# Altium schematic sheet FTDI.SchDoc
size A4; PageSetup: Record=PageOptions|CenterHorizontal=True|CenterVertical=True|PrintScale=1.00|XCorrection=1.00|YCorrection=1.00|PrintKind=2|BorderSize=5000000|LeftOffset=0|BottomOffset=0|Orientation=2|PaperLength=1000|PaperWidth=1000|Scale=100|PaperSource=7|PrintQuality=-3|MediaType=1|DitherType=10|PrintScaleMode=1|PaperKind=A4|PaperIndex=9
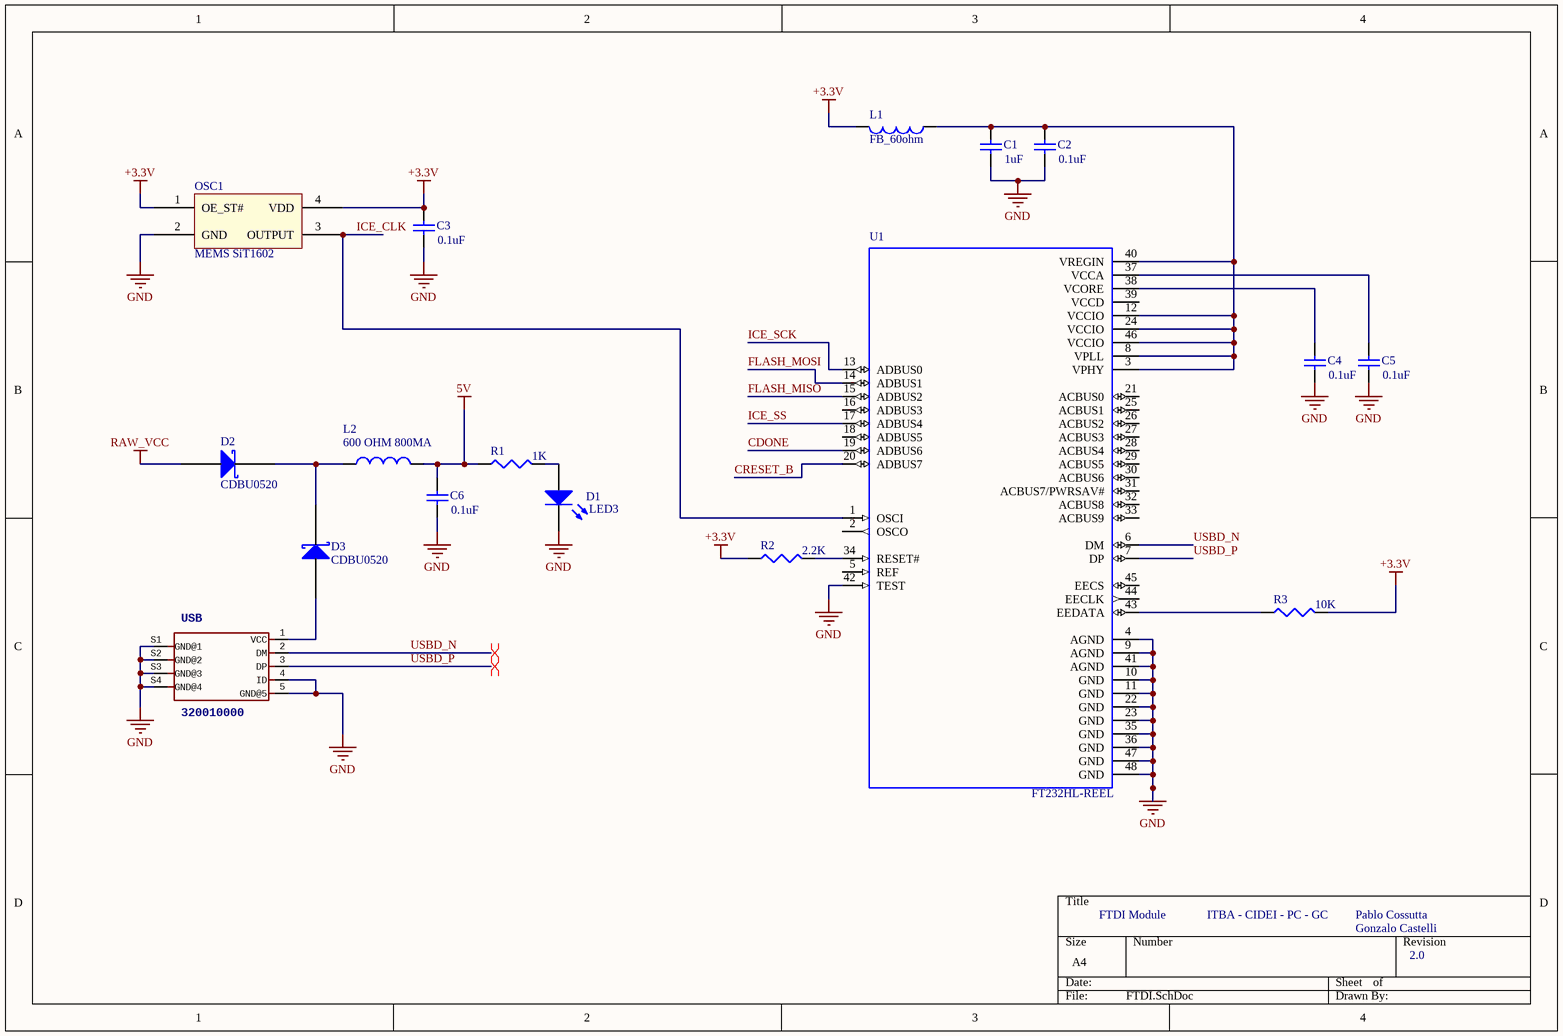
[diagram p0: FTDI.SchDoc]

## Parts
C1  value 1uF  [C0402]  (hidden comment: Cap Semi)
C2  value 0.1uF  [C0402]  (hidden comment: Cap Semi)
C3  value 0.1uF  [C0402]  (hidden comment: Cap Semi)
C4  value 0.1uF  [C0402]  (hidden comment: Cap Semi)
C5  value 0.1uF  [C0402]  (hidden comment: Cap Semi)
C6  value 0.1uF  [C0402]  (hidden comment: Cap Semi)
D1  LED3  [LED-0603]
D2  CDBU0520  [CDBU0520]
D3  CDBU0520  [CDBU0520]
L1  FB_60ohm  [J1-0603]
L2  600 OHM 800MA  [J1-0603]
OSC1  MEMS SiT1602  [oscMEMS1602]
R1  value 1K  [R0402]  (hidden comment: Res3)
R2  value 2.2K  [R0402]  (hidden comment: Res3)
R3  value 10K  [R0402]  (hidden comment: Res3)
U1  FT232HL-REEL  [QFP50P900X900X160-48N]
USB  320010000  [MICRO-USB5+4P-SMD-0.65-B]

## Nets
5V: C6.2 L2.2 R1.1
+3.3V: C3.2 L1.2 OSC1.1(OE_ST#) OSC1.4(VDD) R2.1 R3.2
GND: C1.1 C2.1 C3.1 C4.1 C5.1 C6.1 D1.2(K) OSC1.2(GND) U1.4(AGND) U1.9(AGND) U1.10(GND) U1.11(GND) U1.22(GND) U1.23(GND) U1.35(GND) U1.36(GND) U1.41(AGND) U1.42(TEST) U1.47(GND) U1.48(GND) USB.4(ID) USB.5(GND@5) USB.S1(GND@1) USB.S2(GND@2) USB.S3(GND@3) USB.S4(GND@4)
RAW_VCC: D2.1
CDONE: U1.19(ADBUS6)
CRESET_B: U1.20(ADBUS7)
FLASH_MISO: U1.15(ADBUS2)
FLASH_MOSI: U1.14(ADBUS1)
ICE_CLK: OSC1.3(OUTPUT) U1.1(OSCI)
ICE_SCK: U1.13(ADBUS0)
ICE_SS: U1.17(ADBUS4)
USBD_N: U1.6(DM) USB.2(DM)
USBD_P: U1.7(DP) USB.3(DP)
NetC1_2: C1.2 C2.2 L1.1 U1.3(VPHY) U1.8(VPLL) U1.12(VCCIO) U1.24(VCCIO) U1.40(VREGIN) U1.46(VCCIO)
NetC4_2: C4.2 U1.38(VCORE)
NetC5_2: C5.2 U1.37(VCCA)
NetD1_1: D1.1(A) R1.2
NetD2_2: D2.2 D3.2 L2.1
NetD3_1: D3.1 USB.1(VCC)
NetR2_2: R2.2 U1.34(RESET#)
NetR3_1: R3.1 U1.43(EEDATA)

Not connected (* = marked no-connect by the designer): U1 2(OSCO) 5(REF) 16(ADBUS3) 18(ADBUS5) 21(ACBUS0) 25(ACBUS1) 26(ACBUS2) 27(ACBUS3) 28(ACBUS4) 29(ACBUS5) 30(ACBUS6) 31(ACBUS7/PWRSAV#) 32(ACBUS8) 33(ACBUS9) 39(VCCD) 44(EECLK) 45(EECS)

## Layout directives
differential pair: USBD_N, USBD_P

## Notes on the sheet
- FTDI Module
- ITBA - CIDEI - PC - GC
- Pablo Cossutta
- Gonzalo Castelli
- 2.0

## Library data of the parts
C1 = Cap Semi: Capacitor (Semiconductor SIM Model); Manufacturer: TDK Corporation; Manufacturer Part Number: CGB2A1JB1E105M033BC; Tolerance: ±20%; Voltage - Rated: 25V; Temperature Coefficient: JB; Notification: Current market demand for these product types have resulted in fluctuating and extending lead times. Lead times may differ.; Published: 8-Jun-2000; LatestRevisionDate: 29-May-2009; LatestRevisionNote: IPC-7351 Footprint Added.; PackageReference: C1206; Publisher: Altium Limited; PackageDescription: Chip Capacitor; Supplier 1: Digi-Key; Supplier Part Number 1: 445-12016-1-ND; RoHS: RoHS Compliant; Category: Capacitors; Stock 1: 0; Pricing 1: 1=0.25, 10=0.173, 100=0.0874, 500=0.0598, 1000=0.0529, 2500=0.0506, 5000=0.046 (USD); Packaging: Cut Tape (CT); Part Status: Active; Operating Temperature: -25°C ~ 85°C; Features: Low Profile; Ratings: -; Applications: General Purpose; Failure Rate: -; Mounting Type: Surface Mount, MLCC; Package / Case: 0402 (1005 Metric); Size / Dimension: 0.039" L x 0.020" W (1.00mm x 0.50mm); Height - Seated (Max): -; Thickness (Max): 0.013" (0.33mm); Lead Spacing: -; Lead Style: -; ComponentLink1URL: https://product.tdk.com/info/en/catalog/datasheets/mlcc_commercial_lowprofile_en.pdf; ComponentLink1Description: https://product.tdk.com/info/en/catalog/datasheets/mlcc_commercial_lowprofile_en.pdf
C2-C6 = Cap Semi: Capacitor (Semiconductor SIM Model); Manufacturer: Samsung Electro-Mechanics; Manufacturer Part Number: CL05B104KA5NNNC; Tolerance: ±10%; Voltage - Rated: 25V; Temperature Coefficient: X7R; Notification: Current market demand for these product types have resulted in fluctuating and extending lead times. Lead times may differ.; Published: 8-Jun-2000; LatestRevisionDate: 29-May-2009; LatestRevisionNote: IPC-7351 Footprint Added.; PackageReference: C1206; Publisher: Altium Limited; PackageDescription: Chip Capacitor; Supplier 1: Digi-Key; Supplier Part Number 1: 1276-6720-1-ND; RoHS: RoHS Compliant; Category: Capacitors; Stock 1: 0; Pricing 1: 1=0.1, 10=0.071, 100=0.0317, 500=0.02262, 1000=0.01777, 2500=0.01616, 5000=0.01486 (USD); Packaging: Cut Tape (CT); Part Status: Active; Operating Temperature: -55°C ~ 125°C; Features: -; Ratings: -; Applications: General Purpose; Mounting Type: Surface Mount, MLCC; Package / Case: 0402 (1005 Metric); Size / Dimension: 0.039" L x 0.020" W (1.00mm x 0.50mm); Height - Seated (Max): -; Thickness (Max): 0.022" (0.55mm); Lead Spacing: -; Lead Style: -; ComponentLink1URL: http://www.samsungsem.com/kr/support/product-search/mlcc/CL05B104KA5NNNC.jsp; ComponentLink1Description: http://www.samsungsem.com/kr/support/product-search/mlcc/CL05B104KA5NNNC.jsp
D1 = LED3: Typical BLUE SiC LED; pin to pad: 1>+ 2>-; Manufacturer: Lite-On Inc.; Manufacturer Part Number: LTST-C190TBKT; Configuration: Standard; Lens Color: Colorless; Lens Transparency: Clear; Millicandela Rating: 104mcd; Lens Style: Rectangle with Flat Top; Lens Size: 1.10mm x 0.80mm; Voltage - Forward (Vf) (Typ): 3.3V; Current - Test: 20mA; Viewing Angle: 130°; Wavelength - Dominant: 470nm; Wavelength - Peak: 468nm; Published: 8-Jun-2000; LatestRevisionDate: 17-Dec-2003; LatestRevisionNote: PCB Footprint replaced.; DatasheetVersion: 16-Apr-2002; PackageVersion: 16-Apr-2002; PackageReference: 3.5X2.8X1.9; Publisher: Altium Limited; PackageDescription: SM LED; 2 C-Bend Leads; Body 3.5 x 2.8 x 1.9 mm, inc leads (LxWxH typ); Supplier 1: Digi-Key; Supplier Part Number 1: 160-1646-1-ND; RoHS: RoHS Compliant; Category: Optoelectronics; Stock 1: 732613; Pricing 1: 1=0.55, 10=0.4, 25=0.3088, 100=0.2043, 250=0.15204, 500=0.13024, 1000=0.10847 (USD); Packaging: Cut Tape (CT); Part Status: Active; Color: Blue; Mounting Type: Surface Mount; Features: -; Package / Case: 0603 (1608 Metric); Supplier Device Package: Chip LED; Size / Dimension: 1.60mm L x 0.80mm W; Height (Max): 0.90mm; ComponentLink1URL: http://optoelectronics.liteon.com/upload/download/DS-22-99-0224/LTST-C190TBKT.PDF; ComponentLink1Description: http://optoelectronics.liteon.com/upload/download/DS-22-99-0224/LTST-C190TBKT.PDF
D2 D3 = CDBU0520: DIODE SCHOTTKY 20V 500MA 0603; pin to pad: 1>+ 2>-; Manufacturer: Comchip Technology; Speed: Fast Recovery =< 500ns, > 200mA (Io); Capacitance @ Vr, F: 100pF @ 0V, 1MHz; Packaging: Cut Tape (CT); Base Part Number: CDBU0520; Operating Temperature - Junction: 125°C (Max); Category: Discrete Semiconductor Products; Diode Type: Schottky; Supplier Device Package: 0603/SOD-523F; Package / Case: 2-SMD, No Lead; Mounting Type: Surface Mount; Manufacturer Part Number: CDBU0520; RoHS: RoHS Compliant; Part Status: Active; Current - Average Rectified (Io): 500mA; ComponentLink1URL: http://www.comchiptech.com/admin/files/product/CDBU0520-HF-RevA797161.pdf; ComponentLink1Description: http://www.comchiptech.com/admin/files/product/CDBU0520-HF-RevA797161.pdf; Supplier 1: Digi-Key; Stock 1: 262344; Pricing 1: 1=0.47, 10=0.333, 100=0.2186, 500=0.12916, 1000=0.09935 (USD); Supplier Part Number 1: 641-1332-1-ND
L1 = Inductor: Manufacturer: Laird-Signal Integrity Products; Manufacturer Part Number: HI0603P600R-10; Code_IEC: 1005; Value: 10mH; Filter Type: Power, Signal Line; Current Rating (Max): 4A; DC Resistance (DCR) (Max): 30 mOhm; Published: 8-Jun-2000; LatestRevisionDate: 29-May-2009; LatestRevisionNote: IPC-7351 Footprint Added.; PackageReference: 0402-A; Publisher: Altium Limited; PackageDescription: Chip Inductor; Code_JEITA: 0402; Supplier 1: Digi-Key; Supplier Part Number 1: 240-2376-1-ND; RoHS: RoHS Compliant; Category: Filters; Stock 1: 175172; Pricing 1: 1=0.19, 10=0.156, 25=0.1224, 50=0.1016, 100=0.088, 250=0.07088, 500=0.06402, 1000=0.05375 (USD); Packaging: Cut Tape (CT); Part Status: Active; Ratings: -; Operating Temperature: -40°C ~ 125°C; Package / Case: 0603 (1608 Metric); Mounting Type: Surface Mount; Height (Max): 0.037" (0.95mm); Size / Dimension: 0.063" L x 0.032" W (1.60mm x 0.80mm); ComponentLink1URL: http://assets.lairdtech.com/home/brandworld/files/HI0603P600R-10.pdf; ComponentLink1Description: http://assets.lairdtech.com/home/brandworld/files/HI0603P600R-10.pdf
L2 = Inductor: Manufacturer: Murata Electronics North America; Manufacturer Part Number: BLM18HE601SN1D; Code_IEC: 1005; Value: 10mH; Filter Type: Signal Line; DC Resistance (DCR) (Max): 250 mOhm; Published: 8-Jun-2000; LatestRevisionDate: 29-May-2009; LatestRevisionNote: IPC-7351 Footprint Added.; PackageReference: 0402-A; Publisher: Altium Limited; PackageDescription: Chip Inductor; Code_JEITA: 0402; Supplier 1: Digi-Key; Supplier Part Number 1: 490-5214-1-ND; RoHS: RoHS Compliant; Category: Filters; Stock 1: 152784; Pricing 1: 1=0.22, 10=0.179, 25=0.1392, 50=0.1154, 100=0.0996, 250=0.07964, 500=0.07168, 1000=0.05973 (USD); Packaging: Cut Tape (CT); Part Status: Active; Current Rating (Max): 800mA; Ratings: -; Operating Temperature: -55°C ~ 125°C; Package / Case: 0603 (1608 Metric); Mounting Type: Surface Mount; Height (Max): 0.037" (0.95mm); Size / Dimension: 0.063" L x 0.032" W (1.60mm x 0.80mm); ComponentLink1URL: https://www.murata.com/en-us/products/productdata/8796741599262/ENFA0004.pdf; ComponentLink1Description: https://www.murata.com/en-us/products/productdata/8796741599262/ENFA0004.pdf
OSC1 = SIT1602AC-13-33E-12.000000G: MEMS OSC XO 12.0000MHZ LVCMOS; Manufacturer: SiTIME; Function: Enable/Disable; Voltage - Supply: 3.3V; Frequency Stability: ±50ppm; Current - Supply (Max): 4.5mA; Current - Supply (Disable) (Max): 4mA; Supplier 1: Digi-Key; Manufacturer Part Number: SIT1602AC-13-33E-12.000000G; RoHS: RoHS Compliant; Category: Crystals, Oscillators, Resonators; Packaging: Cut Tape (CT); Part Status: Not For New Designs; Base Resonator: MEMS; Type: XO (Standard); Output: LVCMOS; Operating Temperature: -20°C ~ 70°C; Ratings: -; Mounting Type: Surface Mount; Package / Case: 4-SMD, No Lead; Size / Dimension: 0.098" L x 0.079" W (2.50mm x 2.00mm); Height - Seated (Max): 0.032" (0.80mm); ComponentLink1URL: https://media.digikey.com/pdf/Data%20Sheets/SiTime%20PDFs/SIT1602A.pdf; ComponentLink1Description: https://media.digikey.com/pdf/Data%20Sheets/SiTime%20PDFs/SIT1602A.pdf; Supplier Part Number 1: 1473-1051-1-ND; Pricing 1: 1=1.26, 10=1.118, 50=1.045, 100=0.9236 (USD)
R1 = Res3: Resistor; Manufacturer: Yageo; Manufacturer Part Number: RC0402JR-071KL; Tolerance: ±5%; Power (Watts): 0.063W, 1/16W; Temperature Coefficient: ±100ppm/°C; Published: 8-Jun-2000; LatestRevisionDate: 29-May-2009; LatestRevisionNote: IPC-7351 Footprint Added.; PackageReference: J1-0603; Publisher: Altium Limited; PackageDescription: Chip Resistor; Supplier 1: Digi-Key; Supplier Part Number 1: 311-1.0KJRCT-ND; RoHS: RoHS Compliant; Category: Resistors; Stock 1: 17587061; Pricing 1: 1=0.1, 10=0.015, 100=0.0062, 1000=0.0029, 2500=0.00255, 5000=0.00214 (USD); Packaging: Cut Tape (CT); Part Status: Active; Composition: Thick Film; Features: Moisture Resistant; Operating Temperature: -55°C ~ 155°C; Package / Case: 0402 (1005 Metric); Supplier Device Package: 0402; Size / Dimension: 0.039" L x 0.020" W (1.00mm x 0.50mm); Height - Seated (Max): 0.016" (0.40mm); Failure Rate: -; ComponentLink1URL: http://www.yageo.com/documents/recent/PYu-RC_Group_51_RoHS_L_9.pdf; ComponentLink1Description: http://www.yageo.com/documents/recent/PYu-RC_Group_51_RoHS_L_9.pdf
R2 = Res3: Resistor; Manufacturer: Yageo; Manufacturer Part Number: RC0402FR-072K2L; Tolerance: ±1%; Power (Watts): 0.063W, 1/16W; Temperature Coefficient: ±100ppm/°C; Published: 8-Jun-2000; LatestRevisionDate: 29-May-2009; LatestRevisionNote: IPC-7351 Footprint Added.; PackageReference: J1-0603; Publisher: Altium Limited; PackageDescription: Chip Resistor; Supplier 1: Digi-Key; Supplier Part Number 1: 311-2.20KLRCT-ND; RoHS: RoHS Compliant; Category: Resistors; Stock 1: 13607175; Pricing 1: 1=0.1, 10=0.018, 100=0.0076, 1000=0.00356, 2500=0.00313, 5000=0.00263 (USD); Packaging: Cut Tape (CT); Part Status: Active; Composition: Thick Film; Features: Moisture Resistant; Operating Temperature: -55°C ~ 155°C; Package / Case: 0402 (1005 Metric); Supplier Device Package: 0402; Size / Dimension: 0.039" L x 0.020" W (1.00mm x 0.50mm); Height - Seated (Max): 0.016" (0.40mm); Failure Rate: -; ComponentLink1URL: http://www.yageo.com/documents/recent/PYu-RC_Group_51_RoHS_L_9.pdf; ComponentLink1Description: http://www.yageo.com/documents/recent/PYu-RC_Group_51_RoHS_L_9.pdf
R3 = Res3: Resistor; Manufacturer: Yageo; Manufacturer Part Number: RC0402JR-0710KP; Tolerance: ±5%; Power (Watts): 0.063W, 1/16W; Temperature Coefficient: ±150ppm/°C; Published: 8-Jun-2000; LatestRevisionDate: 29-May-2009; LatestRevisionNote: IPC-7351 Footprint Added.; PackageReference: J1-0603; Publisher: Altium Limited; PackageDescription: Chip Resistor; Supplier 1: Digi-Key; Supplier Part Number 1: YAG1281CT-ND; RoHS: RoHS Compliant; Category: Resistors; Stock 1: 0; Pricing 1: 1=0.1, 10=0.028, 100=0.0119, 1000=0.00557, 2500=0.0049, 5000=0.00411 (USD); Packaging: Cut Tape (CT); Part Status: Active; Composition: Thick Film; Features: Moisture Resistant; Operating Temperature: -55°C ~ 155°C; Package / Case: 0402 (1005 Metric); Supplier Device Package: 0402; Size / Dimension: 0.039" L x 0.020" W (1.00mm x 0.50mm); Height - Seated (Max): 0.016" (0.40mm); Failure Rate: -; ComponentLink1URL: http://www.yageo.com/NewPortal/yageodocoutput?fileName=/pdf/R-Chip/PYu-RC_51_RoHS_P_0.pdf; ComponentLink1Description: http://www.yageo.com/NewPortal/yageodocoutput?fileName=/pdf/R-Chip/PYu-RC_51_RoHS_P_0.pdf
U1 = FT232HL-REEL: IC HS USB TO UART/FIFO 48LQFP; Manufacturer: FTDI, Future Technology Devices International Ltd; Current - Supply: 24mA; Standards: USB 2.0; Interface: UART, FIFO; Function: Bridge, USB to UART,FIFO; Voltage - Supply: 1.62 V ~ 1.98 V, 2.97 V ~ 3.63 V; Category: Integrated Circuits (ICs); Protocol: USB; Packaging: Cut Tape (CT); Manufacturer Part Number: FT232HL-REEL; RoHS: RoHS Compliant; Part Status: Active; Supplier Device Package: 48-LQFP (7x7); Package / Case: 48-LQFP; Operating Temperature: -40°C ~ 85°C; ComponentLink1URL: http://www.ftdichip.com/Support/Documents/DataSheets/ICs/DS_FT232H.pdf; ComponentLink1Description: http://www.ftdichip.com/Support/Documents/DataSheets/ICs/DS_FT232H.pdf; Supplier 1: Digi-Key; Stock 1: 26343; Pricing 1: 1=4.25, 10=3.55, 100=3.1, 250=2.95, 500=2.85002 (USD); Supplier Part Number 1: 768-1101-1-ND
USB = USB MICRO B: CONN USB MICRO B RECPT SMT R/A; Manufacturer: Amphenol FCI; Manufacturer Part Number: 10118193-0001LF; Connector Type: USB - micro B; Number of Contacts: 5; Gender: Receptacle; Specifications: USB 2.0; Current Rating: 1.8A per Contact; Voltage - Rated: 100VAC; Mating Cycles: 10000; Shielding: Shielded; Material Flammability Rating: UL94 V-0; Supplier 1: Digi-Key; RoHS: RoHS Compliant; Category: Connectors, Interconnects; Stock 1: 275888; Packaging: Cut Tape (CT); Part Status: Active; Mounting Type: Surface Mount, Right Angle; Through Hole; Mounting Feature: Horizontal; Termination: Solder; Features: Solder Retention; Ingress Protection: -; Operating Temperature: -30°C ~ 80°C; Contact Finish: Gold; Shell/Shielding Material: Steel, Stainless; Insulation Color: Black; ComponentLink1URL: http://www.amphenol-icc.com/media/wysiwyg/files/drawing/10118193.pdf; ComponentLink1Description: http://www.amphenol-icc.com/media/wysiwyg/files/drawing/10118193.pdf; Supplier Part Number 1: 609-4616-1-ND; Pricing 1: 1=0.45, 10=0.419, 25=0.38, 50=0.3406, 100=0.3275, 250=0.30132, 500=0.28822 (USD)